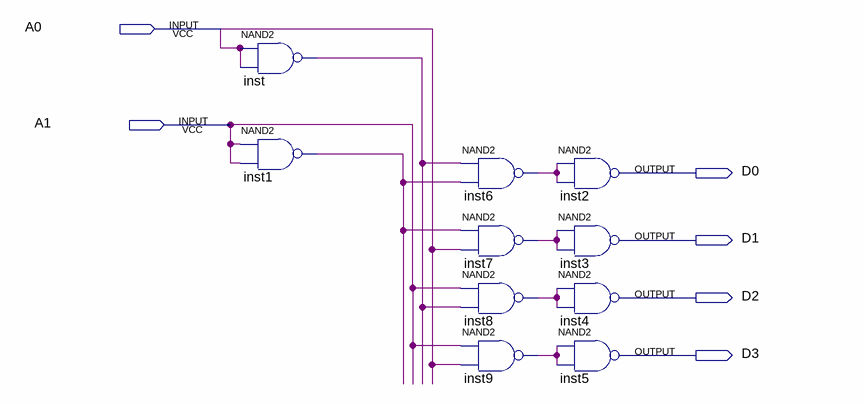
[diagram p0: schematic sheet]
// Quartus schematic lab3_g8_p3.bdf as structural Verilog: 10 symbols, 6 pins
module lab3_g8_p3 (
  input  A0,
  input  A1,
  output D0,
  output D1,
  output D2,
  output D3
);

  wire inst1_out, inst6_out, inst7_out, inst8_out, inst9_out, inst_out;

  nand inst (inst_out, A0, A0);
  nand inst1 (inst1_out, A1, A1);
  nand inst6 (inst6_out, inst_out, inst1_out);
  nand inst7 (inst7_out, inst1_out, A0);
  nand inst8 (inst8_out, A1, inst_out);
  nand inst9 (inst9_out, A1, A0);
  nand inst2 (D0, inst6_out, inst6_out);
  nand inst3 (D1, inst7_out, inst7_out);
  nand inst4 (D2, inst8_out, inst8_out);
  nand inst5 (D3, inst9_out, inst9_out);
endmodule
